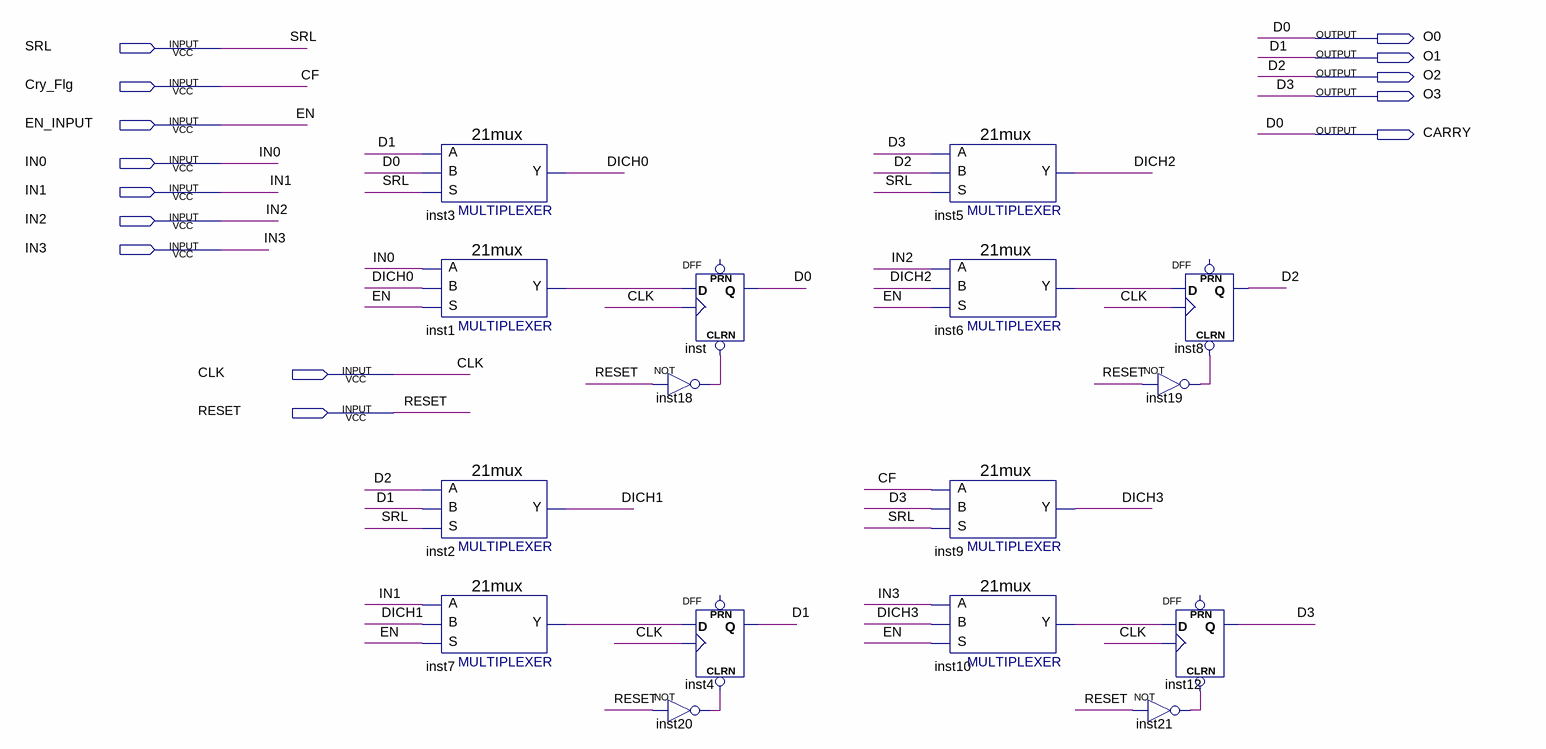
[diagram p0: schematic sheet]
// Quartus schematic SRR4Bit.bdf as structural Verilog: 16 symbols, 14 pins
module SRR4Bit (
  input  SRL,
  input  Cry_Flg,
  input  EN_INPUT,
  input  IN0,
  input  IN1,
  input  IN2,
  input  IN3,
  input  CLK,
  input  RESET,
  output O0,
  output O1,
  output O2,
  output O3,
  output CARRY
);

  wire DICH0, DICH1, DICH2, DICH3, inst1_y, inst6_y, inst7_y, inst10_y, inst18_out, inst19_out, inst20_out,
       inst21_out;

  \21mux  inst3 (.S(SRL), .B(CARRY), .A(O1), .Y(DICH0));
  \21mux  inst1 (.S(EN_INPUT), .B(DICH0), .A(IN0), .Y(inst1_y));
  \21mux  inst2 (.S(SRL), .B(O1), .A(O2), .Y(DICH1));
  \21mux  inst7 (.S(EN_INPUT), .B(DICH1), .A(IN1), .Y(inst7_y));
  DFF inst (.CLRN(inst18_out), .CLK(CLK), .D(inst1_y), .Q(CARRY));  // open: PRN
  not inst18 (inst18_out, RESET);
  DFF inst4 (.CLRN(inst20_out), .CLK(CLK), .D(inst7_y), .Q(O1));  // open: PRN
  not inst20 (inst20_out, RESET);
  \21mux  inst5 (.S(SRL), .B(O2), .A(O3), .Y(DICH2));
  \21mux  inst6 (.S(EN_INPUT), .B(DICH2), .A(IN2), .Y(inst6_y));
  \21mux  inst9 (.S(SRL), .B(O3), .A(Cry_Flg), .Y(DICH3));
  \21mux  inst10 (.S(EN_INPUT), .B(DICH3), .A(IN3), .Y(inst10_y));
  not inst19 (inst19_out, RESET);
  not inst21 (inst21_out, RESET);
  DFF inst8 (.CLRN(inst19_out), .CLK(CLK), .D(inst6_y), .Q(O2));  // open: PRN
  DFF inst12 (.CLRN(inst21_out), .CLK(CLK), .D(inst10_y), .Q(O3));  // open: PRN

  assign O0 = CARRY;

  // Other names for the same wires on the sheet: CF = Cry_Flg; D0 = CARRY; D1 = O1; D2 = O2; D3 = O3; EN = EN_INPUT
endmodule
